# EAGLE design smd_circuit (EAGLE 5.11)
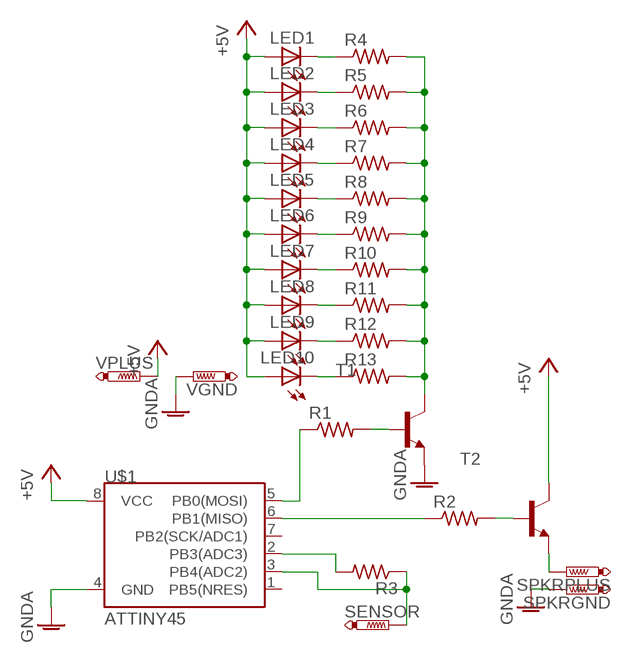
[diagram p0: schematic, sheet 1]

## Parts
LED1  LED5MM  [LED5MM]
LED2  LED5MM  [LED5MM]
LED3  LED5MM  [LED5MM]
LED4  LED5MM  [LED5MM]
LED5  LED5MM  [LED5MM]
LED6  LED5MM  [LED5MM]
LED7  LED5MM  [LED5MM]
LED8  LED5MM  [LED5MM]
LED9  LED5MM  [LED5MM]
LED10  LED5MM  [LED5MM]
R1  R-US_R1206  [R1206]
R2  R-US_R1206  [R1206]
R3  R-US_R1206  [R1206]
R4  R-US_R1206  [R1206]
R5  R-US_R1206  [R1206]
R6  R-US_R1206  [R1206]
R7  R-US_R1206  [R1206]
R8  R-US_R1206  [R1206]
R9  R-US_R1206  [R1206]
R10  R-US_R1206  [R1206]
R11  R-US_R1206  [R1206]
R12  R-US_R1206  [R1206]
R13  R-US_R1206  [R1206]
SENSOR  PTR1PAD1-17Y  [P1-17Y]
SPKRGND  PTR1PAD1-17Y  [P1-17Y]
SPKRPLUS  PTR1PAD1-17Y  [P1-17Y]
T1  NPN-SOT323  [SOT323R]
T2  NPN-SOT323  [SOT323R]
U$1  ATTINY45  [SO08-EIAJ]
VGND  PTR1PAD1-17Y  [P1-17Y]
VPLUS  PTR1PAD1-17Y  [P1-17Y]

## Nets
+5V: LED1.A LED2.A LED3.A LED4.A LED5.A LED6.A LED7.A LED8.A LED9.A LED10.A T2.2(C) U$1.8(VCC) VPLUS.TP
GNDA: SPKRGND.TP T1.3(E) U$1.4(GND) VGND.TP
N$1: R3.2 U$1.2(PB3(ADC3))
N$3: R2.1 U$1.6(PB1(MISO))
N$4: R2.2 T2.1(B)
N$5: R4.2 R5.2 R6.2 R7.2 R8.2 R9.2 R10.2 R11.2 R12.2 R13.2 T1.2(C)
N$6: R1.2 T1.1(B)
N$7: R1.1 U$1.5(PB0(MOSI))
N$8: SPKRPLUS.TP T2.3(E)
N$9: LED1.K(C) R4.1
N$10: LED2.K(C) R5.1
N$11: LED3.K(C) R6.1
N$12: LED4.K(C) R7.1
N$13: LED5.K(C) R8.1
N$14: LED6.K(C) R9.1
N$15: LED7.K(C) R10.1
N$16: LED8.K(C) R11.1
N$17: LED9.K(C) R12.1
N$18: LED10.K(C) R13.1
N$19: R3.1 SENSOR.TP U$1.3(PB4(ADC2))
Unconnected: U$1.1(PB5(NRES)) U$1.7(PB2(SCK/ADC1))

## Library data of the parts
LED1-LED10 = led:LED: LED OSRAM: - CHIPLED LG R971, LG N971, LY N971, LG Q971, LY Q971, LO R971, LY R971 LH N974, LH R974 LS Q976, LO Q976, LY Q976 LO Q996 - Hyper CHIPLED LW Q18S LB Q993, LB Q99A, LB R99A - SideLED LS A670, LO A670, LY A670, LG A670, LP A670 LB A673, LV A673, LT A673, LW A673 LH A674 LY A675 LS A676, LA A676, LO A676, LY A676, LW A676 LS A679, LY A679, LG A679 - Hyper Micro SIDELED® LS Y876, LA Y876, LO Y876, LY Y876 LT Y87S - SmartLED LW L88C, LW L88S LB L89C, LB L89S, LG L890 LS L89K, LO L89K, LY L89K LS L896, LA L896, LO L896, LY L896 - TOPLED LS T670, LO T670, LY T670, LG T670, LP T670 LSG T670, LSP T670, LSY T670, LOP T670, LYG T670 LG T671, LOG T671, LSG T671 LB T673, LV T673, LT T673, LW T673 LH T674 LS T676, LA T676, LO T676, LY T676, LB T676, LH T676, LSB T676, LW T676 LB T67C, LV T67C, LT T67C, LS T67K, LO T67K, LY T67K, LW E67C LS E67B, LA E67B, LO E67B, LY E67B, LB E67C, LV E67C, LT E67C LW T67C LS T679, LY T679, LG T679 LS T770, LO T770, LY T770, LG T770, LP T770 LB T773, LV T773, LT T773, LW T773 LH T774 LS E675, LA E675, LY E675, LS T675 LS T776, LA T776, LO T776, LY T776, LB T776 LHGB T686 LT T68C, LB T68C - Hyper Mini TOPLED® LB M676 - Mini TOPLED Santana® LG M470 LS M47K, LO M47K, LY M47K Source: http://www.osram.convergy.de LUXEON: - LUMILED® LXK2-PW12-R00, LXK2-PW12-S00, LXK2-PW14-U00, LXK2-PW14-V00 LXK2-PM12-R00, LXK2-PM12-S00, LXK2-PM14-U00 LXK2-PE12-Q00, LXK2-PE12-R00, LXK2-PE12-S00, LXK2-PE14-T00, LXK2-PE14-U00 LXK2-PB12-K00, LXK2-PB12-L00, LXK2-PB12-M00, LXK2-PB14-N00, LXK2-PB14-P00, LXK2-PB14-Q00 LXK2-PR12-L00, LXK2-PR12-M00, LXK2-PR14-Q00, LXK2-PR14-R00 LXK2-PD12-Q00, LXK2-PD12-R00, LXK2-PD12-S00 LXK2-PH12-R00, LXK2-PH12-S00 LXK2-PL12-P00, LXK2-PL12-Q00, LXK2-PL12-R00 Source: www.luxeon.com KINGBRIGHT: KA-3528ASYC Source: www.kingbright.com
R1-R13 = rcl:R-US_: RESISTOR, American symbol
SENSOR SPKRGND SPKRPLUS VGND VPLUS = testpad:PTR1: TEST PIN
T1 T2 = bryans_parts:NPN-SOT323
U$1 = SparkFun:ATTINY45: Atmel ATTiny45

## Board
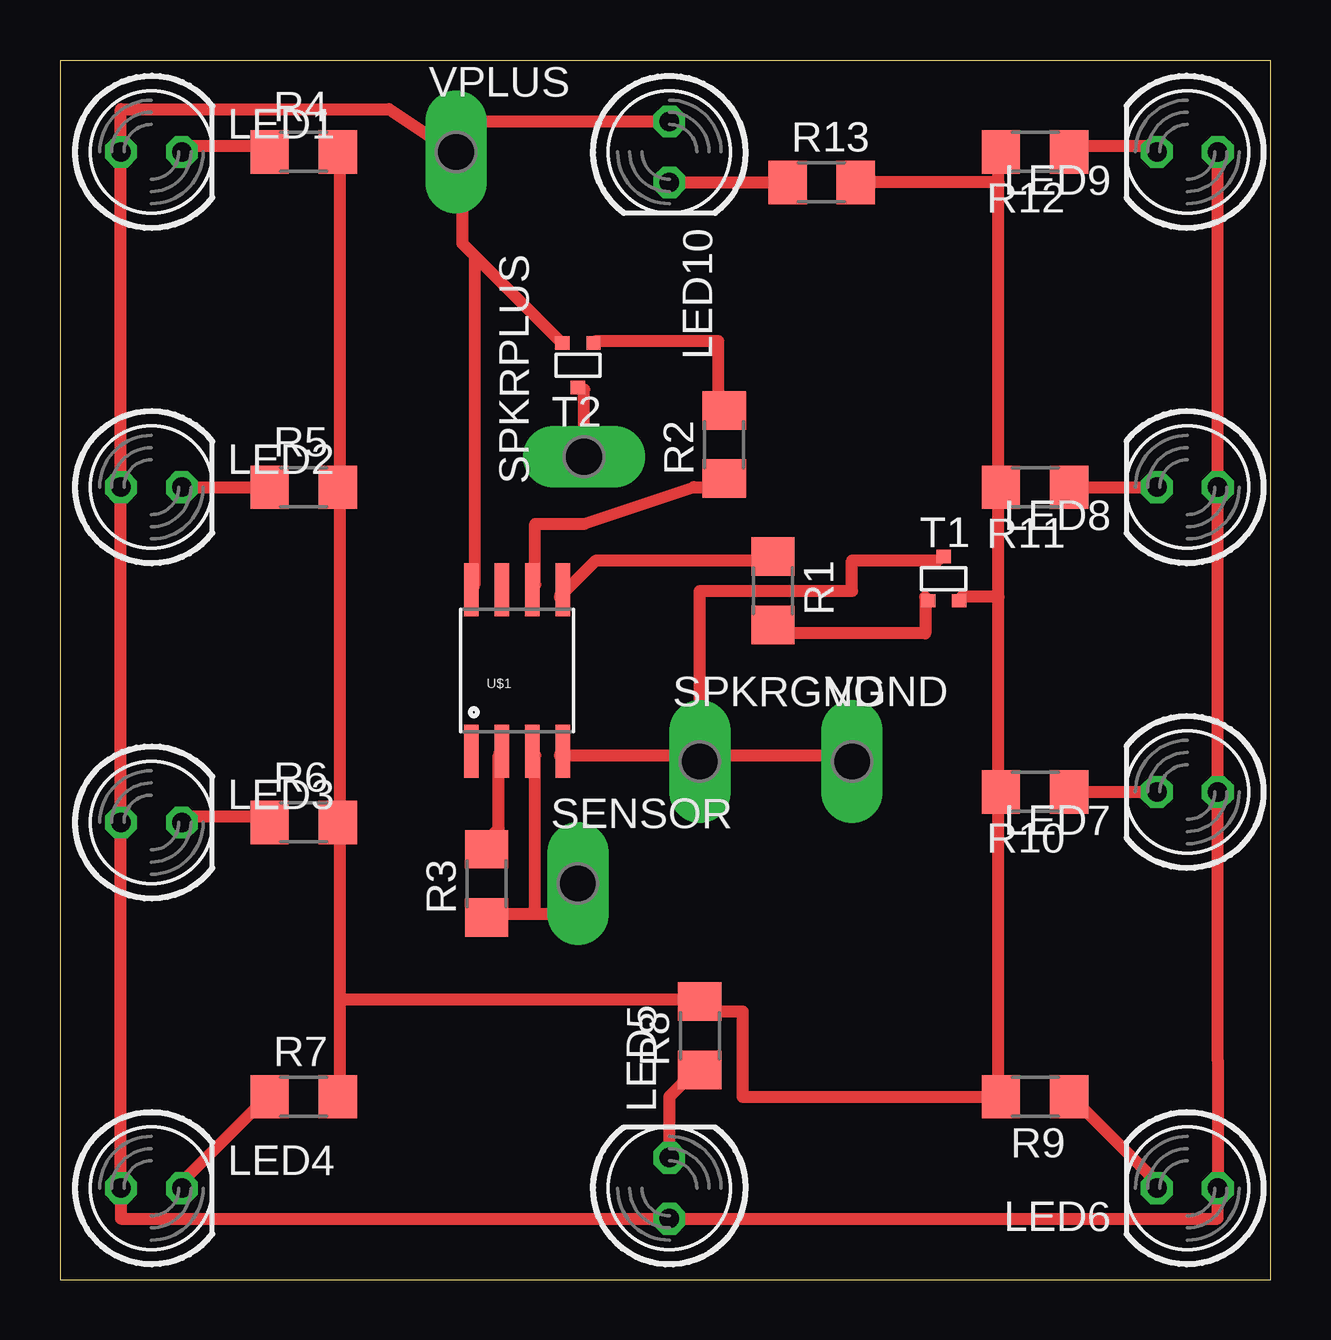
[diagram p1: board, top side]

Size 50.47 x 50.79 mm. Coordinates in mm from the lower left corner, seen from the top.
Outline: 0,0 50.47,0 50.47,50.79 0,50.79 0,0
Copper layers (1*16): Top 0.035mm / dielectric 1.5mm / Bottom 0.035mm
Design rules "default *": minimum track width 20mil, minimum drill 24mil, track to track 8mil, track to pad 8mil, pad to pad 8mil, via to via 8mil, smd to smd 8mil, copper to edge 40mil, drill to drill 8mil, minimum pad ring 10mil, minimum via ring 8mil, stop-mask expansion 4mil, vias tented up to drill 0mil, thermal gap 10mil

### Footprints (pad centres in the part's own frame; a part is rotated, then mirrored left to right if it is on the bottom)
LED5MM = drill 0.813 octagon: A -1.27,0; K 1.27,0
R1206 = smd 1.6 x 1.803: 1 -1.422,0; 2 1.422,0
P1-17Y = drill 1.702 pad 2.121 long: TP 0,0
SOT323R = smd 0.6 x 0.55: 1 -0.65,-0.925; 2 0.65,-0.925; 3 0,0.925
SO08-EIAJ = smd 0.61 x 2.21: 1 -1.905,-3.378; 2 -0.635,-3.378; 3 0.635,-3.378; 4 1.905,-3.378; 5 1.905,3.353; 6 0.635,3.353; 7 -0.635,3.353; 8 -1.905,3.353

### Placement (x,y rotation side)
LED1  3.81,46.99 0 top
LED2  3.81,33.02 0 top
LED3  3.81,19.05 0 top
LED4  3.81,3.81 0 top
LED5  25.4,3.81 90 top
LED6  46.99,3.81 180 top
LED7  46.99,20.32 180 top
LED8  46.99,33.02 180 top
LED9  46.99,46.99 180 top
LED10  25.4,46.99 270 top
R1  29.72,28.7 270 top
R2  27.69,34.8 90 top
R3  17.78,16.51 90 top
R4  10.16,46.99 0 top
R5  10.16,33.02 0 top
R6  10.16,19.05 0 top
R7  10.16,7.62 0 top
R8  26.67,10.16 90 top
R9  40.64,7.62 180 top
R10  40.64,20.32 180 top
R11  40.64,33.02 180 top
R12  40.64,46.99 180 top
R13  31.75,45.72 0 top
SENSOR  21.59,16.51 0 top
SPKRGND  26.67,21.59 0 top
SPKRPLUS  21.84,34.29 90 top
T1  36.83,29.21 0 top
T2  21.59,38.1 180 top
U$1  19.05,25.4 0 top
VGND  33.02,21.59 0 top
VPLUS  16.51,46.99 0 top

### Tracks (layer width: path | path; a pad name or v marks a point on that pad's centre or on a via)
+5V
  Top 0.508: LED9.A LED8.A LED7.A 48.26,9.14 LED6.A 48.26,2.54 LED5.A 2.54,2.54 LED4.A LED3.A LED2.A LED1.A 2.54,48.77 13.72,48.77 16.76,46.74 | 17.27,42.67 16.76,43.18 16.76,46.74 | 17.27,42.67 20.83,39.12 T2.2 | 17.27,42.67 17.27,28.96 U$1.8 | LED10.A 16.76,48.26 16.76,47.24 VPLUS.TP | 16.76,46.74 VPLUS.TP | VPLUS.TP 16.26,47.24
GNDA
  Top 0.508: U$1.4 20.83,21.84 26.42,21.84 SPKRGND.TP | SPKRGND.TP 26.92,21.84 33.02,21.84 VGND.TP | T1.3 36.58,29.97 33.02,29.97 33.02,28.7 26.67,28.7 SPKRGND.TP
N$1
  Top 0.508: R3.2 17.78,18.29 18.29,18.8 18.29,21.84 U$1.2
N$3
  Top 0.508: R2.1 27.43,33.02 26.42,33.02 21.84,31.5 19.81,31.5 19.81,28.96 U$1.6
N$4
  Top 0.508: T2.1 22.35,39.12 27.43,39.12 27.43,36.58 R2.2
N$5
  Top 0.508: 39.12,45.72 39.12,46.74 R12.2 | 39.12,45.72 R13.2 | 39.12,7.62 39.12,20.32 | 39.12,20.32 39.12,28.45 | 39.12,28.45 39.12,33.02 | 39.12,20.32 R10.2 | 39.12,33.02 39.12,45.72 | 39.12,33.02 R11.2 | 11.68,33.02 11.68,46.74 R4.2 | 11.68,11.68 11.68,18.8 R6.2 11.68,19.3 11.68,33.02 | 11.68,11.68 11.68,7.62 R7.2 | 11.68,11.68 26.42,11.68 R8.2 26.92,11.18 28.45,11.18 28.45,7.62 39.12,7.62 | 11.68,33.02 R5.2 | 39.12,7.62 R9.2 | 39.12,28.45 37.59,28.45 T1.2
N$6
  Top 0.508: T1.1 36.07,28.45 36.07,26.92 29.72,26.92 R1.2 29.46,26.92
N$7
  Top 0.508: R1.1 29.46,29.97 22.35,29.97 20.83,28.45 U$1.5
N$8
  Top 0.508: T2.3 21.84,37.08 SPKRPLUS.TP
N$9
  Top 0.508: R4.1 8.64,47.24 5.08,47.24 LED1.K
N$10
  Top 0.508: LED2.K R5.1
N$11
  Top 0.508: R6.1 8.64,19.3 5.08,19.3 LED3.K
N$12
  Top 0.508: R7.1 8.64,7.62 5.08,4.06 LED4.K
N$13
  Top 0.508: LED5.K 25.4,7.62 26.42,8.64 R8.1
N$14
  Top 0.508: R9.1 42.16,7.62 45.72,4.06 LED6.K
N$15
  Top 0.508: R10.1 LED7.K
N$16
  Top 0.508: R11.1 LED8.K
N$17
  Top 0.508: R12.1 42.16,47.24 45.72,47.24 LED9.K
N$18
  Top 0.508: LED10.K R13.1
N$19
  Top 0.508: 19.81,15.24 21.34,15.24 21.34,16.26 SENSOR.TP | 19.81,15.24 17.78,15.24 R3.1 | 19.81,15.24 19.81,21.84 U$1.3